# Altium schematic sheet POWER.SchDoc
size A; SheetNumber: 10; SheetTotal: 10
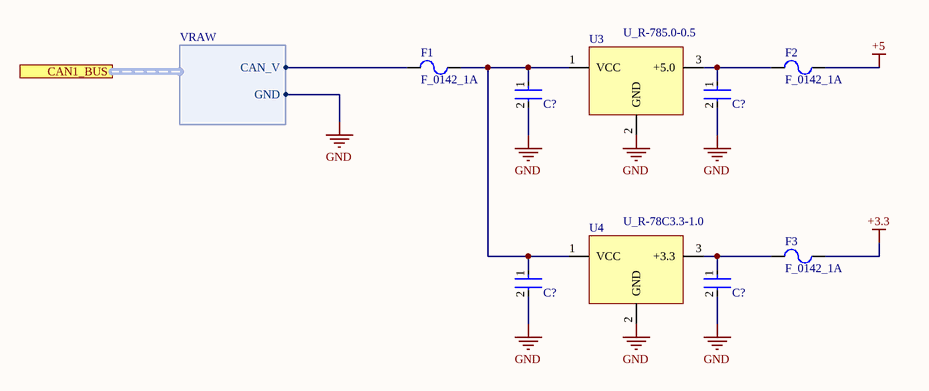
[diagram p0: POWER.SchDoc]

## Parts
(Parts that share a designator on the sheet are numbered #1, #2 ... from top to bottom, then left to right.)
C?#1  C0603C104K5RAC7411  [FP-C0603C-CF-IPC_B]  (value not drawn)
C?#2  C0603C104K5RAC7411  [FP-C0603C-CF-IPC_B]  (value not drawn)
C?#3  C0603C104K5RAC7411  [FP-C0603C-CF-IPC_B]  (value not drawn)
C?#4  C0603C104K5RAC7411  [FP-C0603C-CF-IPC_B]  (value not drawn)
F1  F_0142_1A  [0154_FUSE_HOLDER]
F2  F_0142_1A  [0154_FUSE_HOLDER]
F3  F_0142_1A  [0154_FUSE_HOLDER]
U3  U_R-785.0-0.5  [SIP3]
U4  U_R-78C3.3-1.0  [SIP3]

## Ports
CAN1_BUS (harness VRAW)

## Harnesses
VRAW: CAN_V, GND

## Nets
+3.3: F3.2
+5: F2.2
GND: C?#1.2 C?#2.2 C?#3.2 C?#4.2 U3.2(GND) U4.2(GND)
NetC?#1_1: C?#1.1 C?#3.1 F1.2 U3.1(VCC) U4.1(VCC)
NetC?#2_1: C?#2.1 F2.1 U3.3(+5.0)
NetC?#4_1: C?#4.1 F3.1 U4.3(+3.3)

Not connected (* = marked no-connect by the designer): F1 1

## Library data of the parts
C?#1-C?#4 = CMP-001-00083-3: Cap Ceramic 0.1uF 50V X7R 10% SMD 0603 125C T/R
F1-F3 = CMP-047-000000-1: Fuse Block 10A 125V 1 Circuit Cartridge Surface Mount; Manufacturer: Littelfuse Inc.; SVP Creator: Spencer Berglund; Current: 1A; Design Item ID: F_0142_1A; DigiKey PN: F1889-ND; Source: misc.SchLib
U3 = CMP-110-000001-1: IC REG 0.5A 5.0V; Manufacturer: Recom Power; SVP Creator: Vivien Wang; ComponentLink1URL: http://www.digikey.com/product-search/en?vendor=0&keywords=R-785.0-0.5; Manufacturer PN: R-785.0-0.5; Design Item ID: U_R-785.0-0.5; ComponentLink1Description: Datasheet; Source: Common.SchLib; Price: 6.81; Known Distributors: Digikey
U4 = CMP-093-000004-1: IC REG 1A 3.3V; Manufacturer: Recom Power; Voltage - Input (Max): 42V; Efficiency: 89%; SVP Creator: Vivien Wang; Voltage - Input (Min): 7V; Source: BP_Control.SchLib; Size / Dimension: 0.45" L x 0.30" W x 0.40" H (11.5mm x 7.5mm x 10.2mm); Design Item ID: U_R-78C3.3-1.0; Voltage - Output 1: 3.3V; Manufacturer PN: R-78C3.3-1.0; Current - Output (Max): 1A